# EAGLE design ShieldWing (EAGLE 9.0.1)
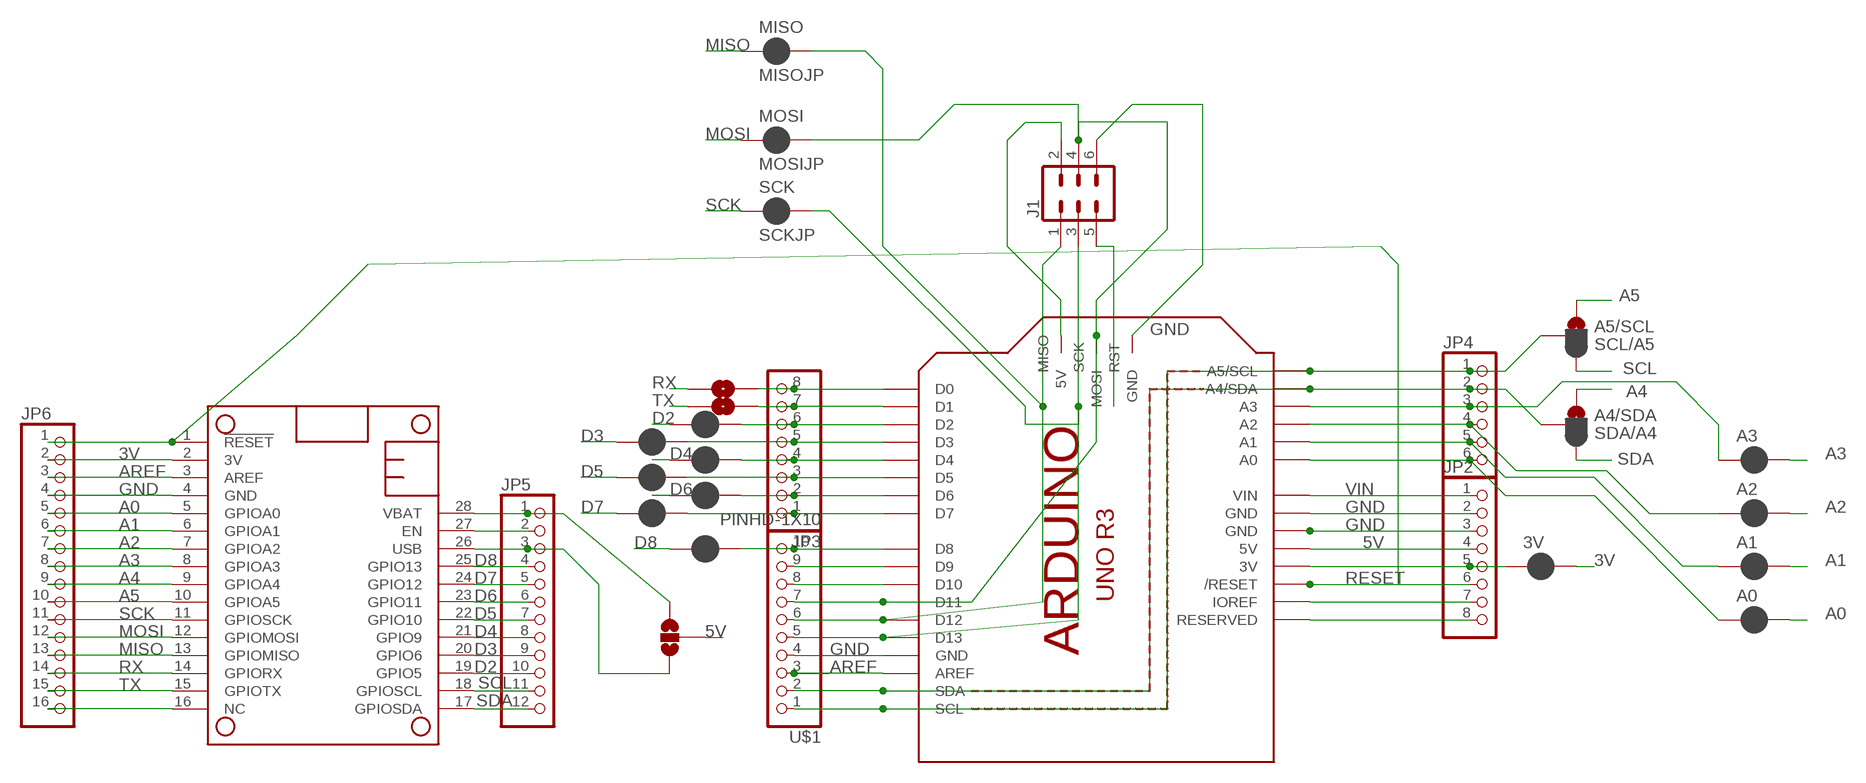
[diagram p0: schematic, sheet 1]

## Parts
3V  JUMPER-SMT_2_NC_PASTE_SILK  [SMT-JUMPER_2_NC_PASTE_SILK]
5V  JUMPER-SMT_3_NO_SILK  [SMT-JUMPER_3_NO_SILK]
A0  JUMPER-SMT_2_NC_PASTE_SILK  [SMT-JUMPER_2_NC_PASTE_SILK]
A1  JUMPER-SMT_2_NC_PASTE_SILK  [SMT-JUMPER_2_NC_PASTE_SILK]
A2  JUMPER-SMT_2_NC_PASTE_SILK  [SMT-JUMPER_2_NC_PASTE_SILK]
A3  JUMPER-SMT_2_NC_PASTE_SILK  [SMT-JUMPER_2_NC_PASTE_SILK]
A4/SDA  SDA/A4  JUMPER-SMT_3_1-NC_PASTE_SILK  [SMT-JUMPER_3_1-NC_PASTE_SILK]
A5/SCL  SCL/A5  JUMPER-SMT_3_1-NC_PASTE_SILK  [SMT-JUMPER_3_1-NC_PASTE_SILK]
D2  JUMPER-SMT_2_NC_PASTE_SILK  [SMT-JUMPER_2_NC_PASTE_SILK]
D3  JUMPER-SMT_2_NC_PASTE_SILK  [SMT-JUMPER_2_NC_PASTE_SILK]
D4  JUMPER-SMT_2_NC_PASTE_SILK  [SMT-JUMPER_2_NC_PASTE_SILK]
D5  JUMPER-SMT_2_NC_PASTE_SILK  [SMT-JUMPER_2_NC_PASTE_SILK]
D6  JUMPER-SMT_2_NC_PASTE_SILK  [SMT-JUMPER_2_NC_PASTE_SILK]
D7  JUMPER-SMT_2_NC_PASTE_SILK  [SMT-JUMPER_2_NC_PASTE_SILK]
D8  JUMPER-SMT_2_NC_PASTE_SILK  [SMT-JUMPER_2_NC_PASTE_SILK]
J1  CONN_03X22X3_SILK_MALE_PTH  [2X3]
JP2  PINHD-1X8CLEANBIG  [1X08-CLEANBIG]
JP3  PINHD-1X8CLEANBIG  [1X08-CLEANBIG]
JP4  PINHD-1X6B  [1X06-BIG]
JP5  PINHD-1X12  [1X12]
JP6  PINHD-1X16  [1X16]
M1  ARDUINO_R3_ICSP_NODIM  [ARDUINOR3_ICSP_NODIM]
MISO  MISOJP  JUMPER-SMT_2_NC_PASTE_SILK  [SMT-JUMPER_2_NC_PASTE_SILK]
MOSI  MOSIJP  JUMPER-SMT_2_NC_PASTE_SILK  [SMT-JUMPER_2_NC_PASTE_SILK]
MS1  FEATHERWING_NODIM  [FEATHERWING_DIM]
RX  JUMPER-SMT_2_NO_SILK  [SMT-JUMPER_2_NO_SILK]
SCK  SCKJP  JUMPER-SMT_2_NC_PASTE_SILK  [SMT-JUMPER_2_NC_PASTE_SILK]
TX  JUMPER-SMT_2_NO_SILK  [SMT-JUMPER_2_NO_SILK]
U$1  PINHD-1X10  [1X10-BIG]

## Nets
3V: 3V.2 JP6.2 MS1.2(3V)
5V: 5V.2 JP2.4 M1.5V
A0: A0.2 JP6.5 MS1.5(GPIOA0)
A1: A1.2 JP6.6 MS1.6(GPIOA1)
A2: A2.2 JP6.7 MS1.7(GPIOA2)
A3: A3.2 JP6.8 MS1.8(GPIOA3)
A4: A4/SDA.1 JP6.9 MS1.9(GPIOA4)
A5: A5/SCL.1 JP6.10 MS1.10(GPIOA5)
AREF: JP6.3 M1.AREF MS1.3(AREF) U$1.3
D2: D2.1 JP5.10 MS1.19(GPIO5)
D3: D3.1 JP5.9 MS1.20(GPIO6)
D4: D4.1 JP5.8 MS1.21(GPIO9)
D5: D5.1 JP5.7 MS1.22(GPIO10)
D6: D6.1 JP5.6 MS1.23(GPIO11)
D7: D7.1 JP5.5 MS1.24(GPIO12)
D8: D8.1 JP5.4 MS1.25(GPIO13)
GND: J1.6 JP2.2 JP2.3 JP6.4 M1.GND M1.GND@1(GND) M1.GND@2(GND) M1.GND@3(GND) MS1.4(GND) U$1.4
MISO: JP6.13 MISO.1 MS1.13(GPIOMISO)
MOSI: JP6.12 MOSI.1 MS1.12(GPIOMOSI)
N$1: JP3.7 M1.D1 TX.2
N$2: JP3.8 M1.D0 RX.2
N$3: JP5.2 MS1.27(EN)
N$10: A4/SDA.2 JP4.2 M1.A4(A4/SDA) M1.SDA U$1.2
N$11: A5/SCL.2 JP4.1 M1.A5(A5/SCL) M1.SCL U$1.1
N$12: 3V.1 JP2.5 M1.3V
N$13: A3.1 JP4.3 M1.A3
N$14: A2.1 JP4.4 M1.A2
N$15: A1.1 JP4.5 M1.A1
N$16: A0.1 JP4.6 M1.A0
N$18: JP2.7 M1.IOREF
N$19: JP2.8 M1.RESERVED
N$20: J1.3 M1.D13 M1.SCK SCK.2 U$1.5
N$21: J1.1 M1.D12 M1.MISO MISO.2 U$1.6
N$22: J1.4 M1.D11 M1.MOSI MOSI.2 U$1.7
N$23: M1.D10 U$1.8
N$24: M1.D9 U$1.9
N$25: D8.2 M1.D8 U$1.10
N$26: D7.2 JP3.1 M1.D7
N$27: D6.2 JP3.2 M1.D6
N$28: D5.2 JP3.3 M1.D5
N$29: D4.2 JP3.4 M1.D4
N$30: D3.2 JP3.5 M1.D3
N$31: D2.2 JP3.6 M1.D2
N$32: J1.2 M1.5V_ICSP(5V)
N$35: J1.5 M1.RESET_ICSP(RST)
N$45: JP6.16 MS1.16(NC)
RESET: JP2.6 JP6.1 M1.RESET(/RESET) MS1.1(!RESET)
RX: JP6.14 MS1.14(GPIORX) RX.1
SCK: JP6.11 MS1.11(GPIOSCK) SCK.1
SCL: A5/SCL.3 JP5.11 MS1.18(GPIOSCL)
SDA: A4/SDA.3 JP5.12 MS1.17(GPIOSDA)
TX: JP6.15 MS1.15(GPIOTX) TX.1
USB: 5V.1 JP5.3 MS1.26(USB)
VBAT: 5V.3 JP5.1 MS1.28(VBAT)
VIN: JP2.1 M1.VIN

## Library data of the parts
3V A0 A1-A3 D2-D8 MISO MOSI SCK = SparkFun-Jumpers:JUMPER-SMT_2_NC_PASTE: Normally closed solder jumper This jumper has an aperture in the stencil to allow solder paste to bridge the split in the wire so it's normally closed (NC). Wick off the solder to open the connection. Reapply solder to reclose the connection.
5V = SparkFun-Jumpers:JUMPER-SMT_3_NO: Normally open jumper This jumper has three pads in close proximity to each other. Apply solder to close the connection(s).
A4/SDA A5/SCL = SparkFun-Jumpers:JUMPER-SMT_3_1-NC_PASTE: Normally closed solder jumper (1 of 2 connections) This jumper has an aperture in the stencil to allow solder paste to bridge one of the two connections. One connection is normally closed (NC), while the other is normally open (NO). Wick off the solder to open the connection. Reapply solder to reclose the connection. Apply solder to the other side instead to change the current path.
J1 = SparkFun-Connectors:CONN_03X2: Multi connection point. Often used as Generic Header-pin footprint for 0.1 inch spaced/style header connections You can populate with any combo of single row headers, but if you'd like an exact match, check these: Header - 2x3 (Male, 0.1") <https://www.sparkfun.com/products/12807> (PRT-12807) Header - 2x3 (Female, 0.1") <https://www.sparkfun.com/products/13010> (PRT-13010) 2x3 Pin Shrouded Header <https://www.sparkfun.com/products/10877> (PRT-10877) On any of the 0.1 inch spaced packages, you can populate with these: Break Away Headers - Straight <https://www.sparkfun.com/products/116> (PRT-00116) Break Away Male Headers - Right Angle <https://www.sparkfun.com/products/553> (PRT-00553) Female Headers <https://www.sparkfun.com/products/115> (PRT-00115) Break Away Headers - Machine Pin <https://www.sparkfun.com/products/117> (PRT-00117) Break Away Female Headers - Swiss Machine Pin <https://www.sparkfun.com/products/743> (PRT-00743) Special note: the shrouded connector mates well with our 3x2 ribbon cables: Ribbon Crimp Connector - 6-pin (2x3, Female) <https://www.sparkfun.com/products/10651> (PRT-10651) Ribbon Cable - 6 wire (15ft) <https://www.sparkfun.com/products/10646> (PRT-10646); PROD_ID: CONN-09701
JP2 JP3 = adafruit:PINHD-1X8: PIN HEADER
JP4 = adafruit:PINHD-1X6: PIN HEADER
JP5 = adafruit:PINHD-1X12: PIN HEADER
JP6 = pinhead:PINHD-1X16: PIN HEADER
M1 = adafruit:ARDUINO_R3_ICSP
MS1 = adafruit:FEATHERWING
RX TX = SparkFun-Jumpers:JUMPER-SMT_2_NO: Normally open jumper This jumper has two pads in close proximity to each other. Apply solder to close the connection. Round pads are easier to solder for beginners, but are a lot larger. SparkFun Product that uses the round pads: SparkFun EL Sequencer <https://www.sparkfun.com/products/12781>
U$1 = adafruit:PINHD-1X10: Pin header 1x10 0.1" spacing With round pins

## Board
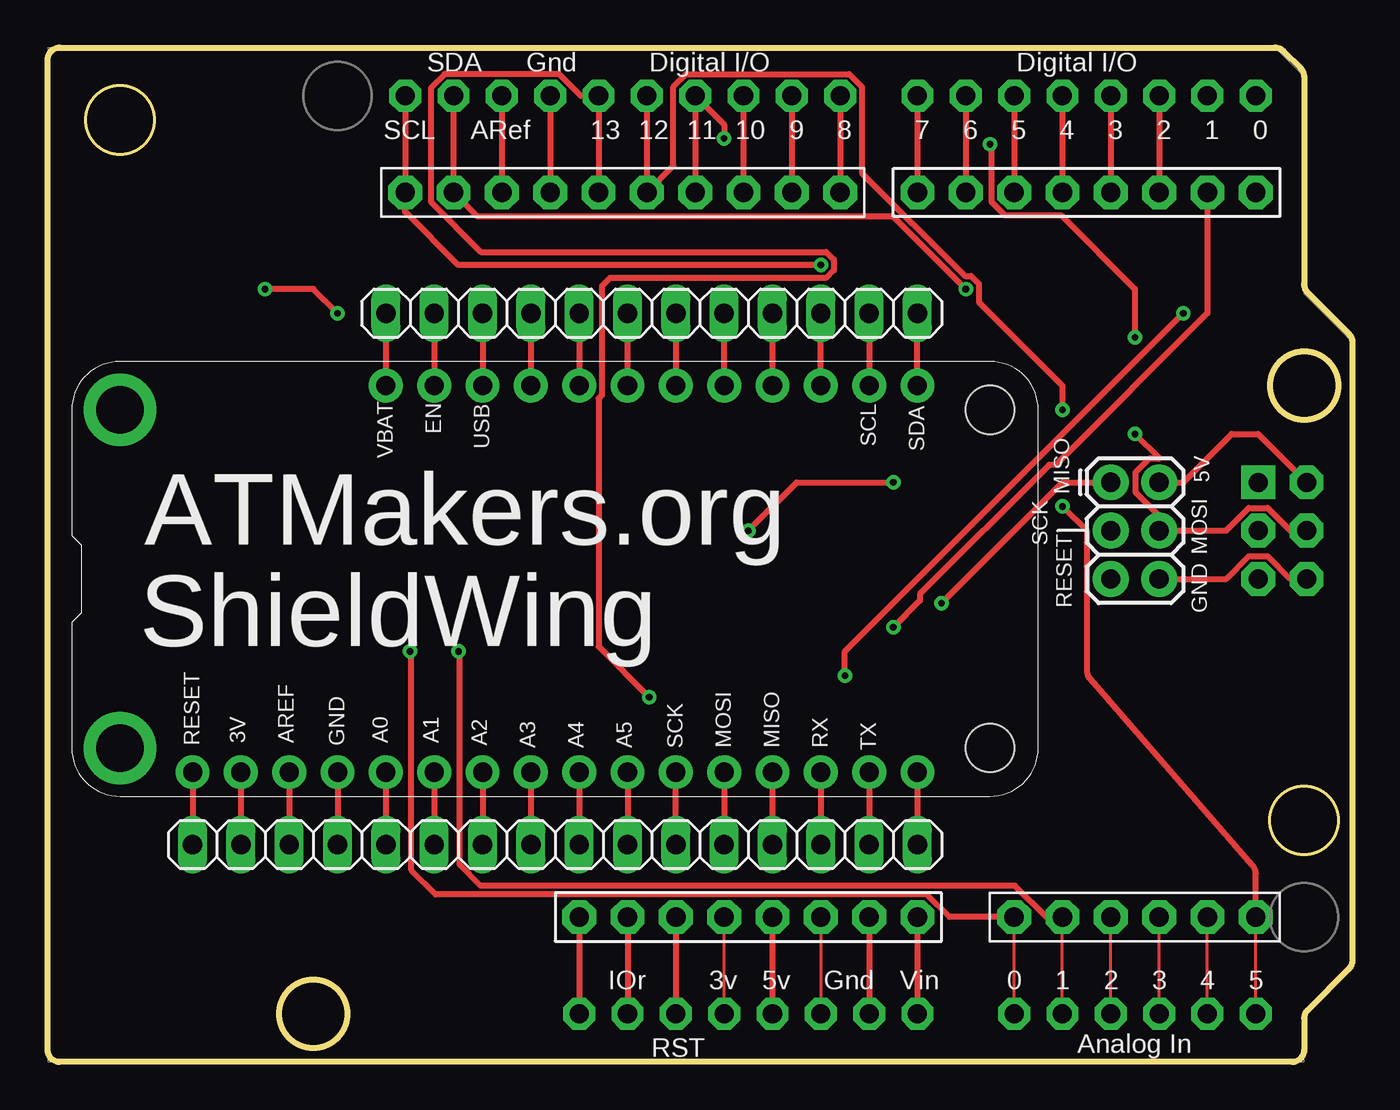
[diagram p1: board, top side]
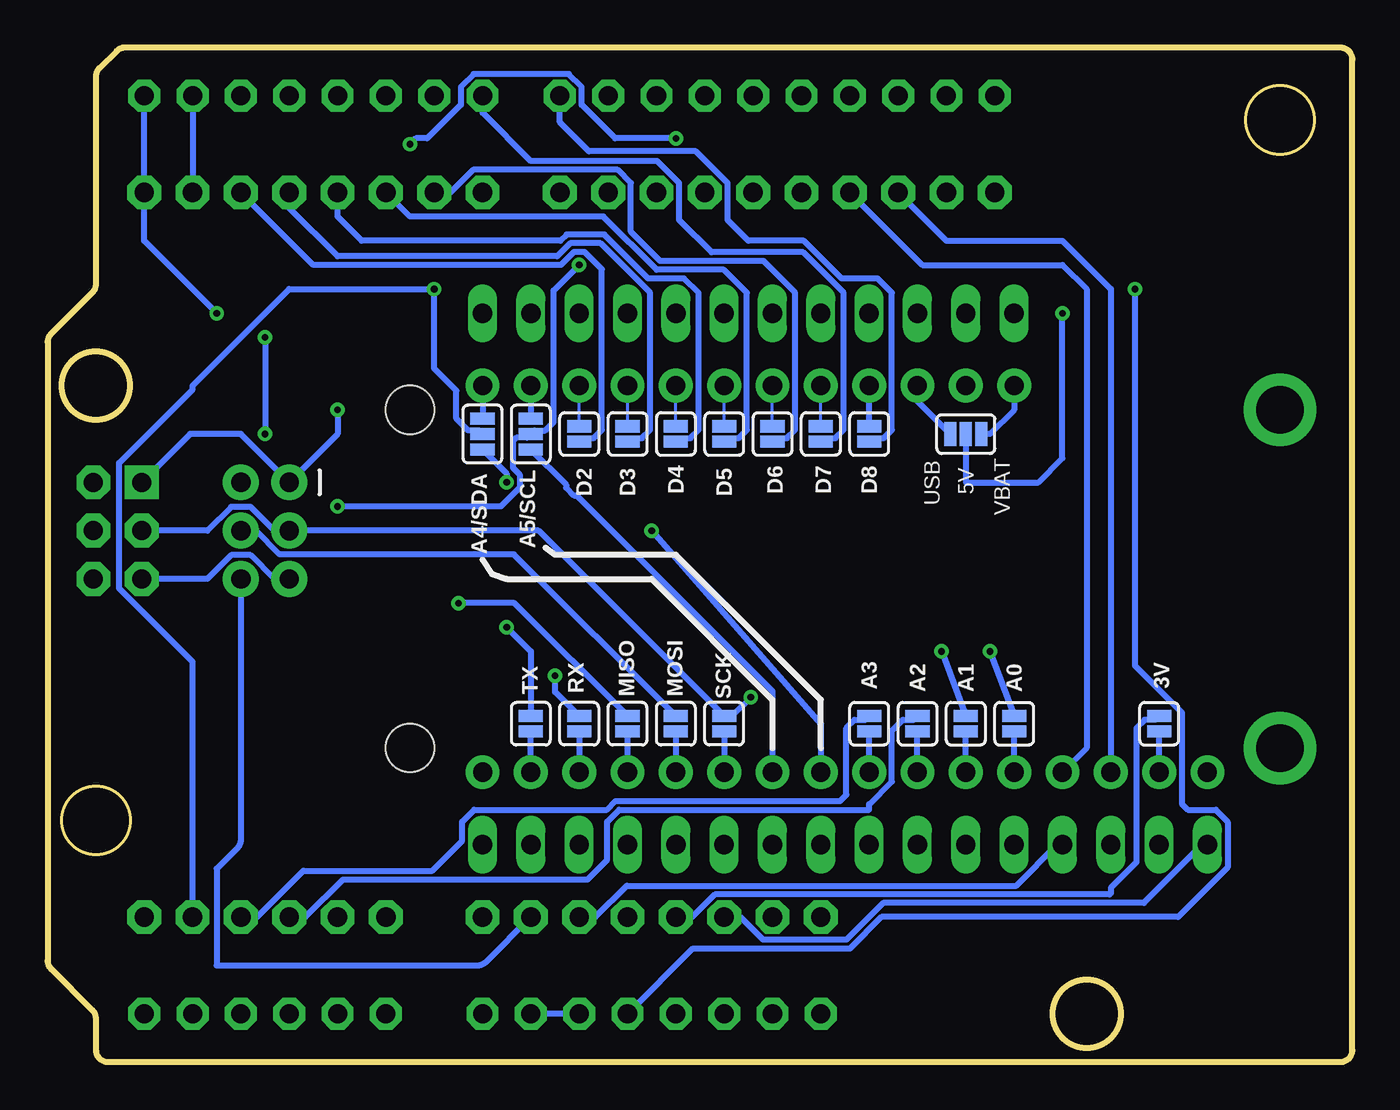
[diagram p2: board, bottom side, seen from below]

Size 68.58 x 53.34 mm. Coordinates in mm from the lower left corner, seen from the top.
Outline: 65.41,0 0.64,0 arc-90 0,0.64 0,52.7 arc-90 0.64,53.34 64.51,53.34 arc-45 64.96,53.15 65.85,52.26 arc-45 66.04,51.81 66.04,40.9 arc45 66.23,40.45 68.39,38.29 arc-45 68.58,37.84 68.58,5.34 arc-45 68.39,4.89 66.23,2.73 arc45 66.04,2.28 66.04,0.64 arc-90 65.41,0
Outline: circle at 13.97,2.54 radius 1.8
Outline: circle at 66.04,35.56 radius 1.8
Outline: circle at 3.81,49.53 radius 1.8
Outline: circle at 66.04,12.7 radius 1.8
Copper layers (1*16): Top 0.035mm / dielectric 1.5mm / Bottom 0.035mm
Design rules "default *": minimum track width 6mil, minimum drill 0.35mm, track to track 6mil, track to pad 6mil, pad to pad 6mil, via to via 6mil, smd to smd 6mil, copper to edge 40mil, drill to drill 6mil, minimum pad ring 10mil, minimum via ring 8mil, stop-mask expansion 4mil, vias tented up to drill 20mil, thermal gap 10mil

### Footprints (pad centres in the part's own frame; a part is rotated, then mirrored left to right if it is on the bottom)
SMT-JUMPER_2_NC_PASTE_SILK = smd 0.635 x 1.27: 1 -0.406,0; 2 0.406,0
SMT-JUMPER_3_NO_SILK = smd 0.635 x 1.27: 1 -0.813,0; 2 0,0; 3 0.813,0
SMT-JUMPER_3_1-NC_PASTE_SILK = smd 0.635 x 1.27: 1 -0.813,0; 2 0,0; 3 0.813,0
2X3 = drill 1.016 pad 1.88: 1 0,0; 2 0,2.54; 3 2.54,0; 4 2.54,2.54; 5 5.08,0; 6 5.08,2.54
1X08-CLEANBIG = drill 1.016 pad 1.778 octagon: 1 -8.89,0; 2 -6.35,0; 3 -3.81,0; 4 -1.27,0; 5 1.27,0; 6 3.81,0; 7 6.35,0; 8 8.89,0
1X06-BIG = drill 1.016 pad 1.778 octagon: 1 -6.35,0; 2 -3.81,0; 3 -1.27,0; 4 1.27,0; 5 3.81,0; 6 6.35,0
1X12 = drill 1.016 long: 1 -13.97,0; 2 -11.43,0; 3 -8.89,0; 4 -6.35,0; 5 -3.81,0; 6 -1.27,0; 7 1.27,0; 8 3.81,0; 9 6.35,0; 10 8.89,0; 11 11.43,0; 12 13.97,0
1X16 = drill 1.016 long: 1 -19.05,0; 2 -16.51,0; 3 -13.97,0; 4 -11.43,0; 5 -8.89,0; 6 -6.35,0; 7 -3.81,0; 8 -1.27,0; 9 1.27,0; 10 3.81,0; 11 6.35,0; 12 8.89,0; 13 11.43,0; 14 13.97,0; 15 16.51,0; 16 19.05,0
ARDUINOR3_ICSP_NODIM = drill 1 pad 1.676 octagon: 3V 35.56,2.54; 5V 38.1,2.54; A0 50.8,2.54; A1 53.34,2.54; A2 55.88,2.54; A3 58.42,2.54; A4 60.96,2.54; A5 63.5,2.54; AREF 23.876,50.8; D0 63.5,50.8; D1 60.96,50.8; D2 58.42,50.8; D3 55.88,50.8; D4 53.34,50.8; D5 50.8,50.8; D6 48.26,50.8; D7 45.72,50.8; D8 41.656,50.8; D9 39.116,50.8; D10 36.576,50.8; D11 34.036,50.8; D12 31.496,50.8; D13 28.956,50.8; GND 26.416,50.8; GND@1 43.18,2.54; GND@2 40.64,2.54; IOREF 30.48,2.54; RESERVED 27.94,2.54; RESET 33.02,2.54; SCL 18.796,50.8; SDA 21.336,50.8; VIN 45.72,2.54 | drill 1 pad 1.778 octagon: 5V_ICSP 66.167,30.48; GND@3 66.167,25.4; MOSI 66.167,27.94; RESET_ICSP 63.627,25.4; SCK 63.627,27.94 | drill 1 pad 1.778 square: MISO 63.627,30.48
FEATHERWING_DIM = drill 1 pad 1.778: 1 6.35,1.27; 2 8.89,1.27; 3 11.43,1.27; 4 13.97,1.27; 5 16.51,1.27; 6 19.05,1.27; 7 21.59,1.27; 8 24.13,1.27; 9 26.67,1.27; 10 29.21,1.27; 11 31.75,1.27; 12 34.29,1.27; 13 36.83,1.27; 14 39.37,1.27; 15 41.91,1.27; 16 44.45,1.27; 17 44.45,21.59; 18 41.91,21.59; 19 39.37,21.59; 20 36.83,21.59; 21 34.29,21.59; 22 31.75,21.59; 23 29.21,21.59; 24 26.67,21.59; 25 24.13,21.59; 26 21.59,21.59; 27 19.05,21.59; 28 16.51,21.59 | drill 2.5 pad 3.81: P$1 2.54,20.32; P$2 2.54,2.54 | hole 2.54: 48.26,20.32; 48.26,2.54
SMT-JUMPER_2_NO_SILK = smd 0.635 x 1.27: 1 -0.406,0; 2 0.406,0
1X10-BIG = drill 1.016 pad 1.778 octagon: 1 -11.43,0; 2 -8.89,0; 3 -6.35,0; 4 -3.81,0; 5 -1.27,0; 6 1.27,0; 7 3.81,0; 8 6.35,0; 9 8.89,0; 10 11.43,0

### Placement (x,y rotation side)
3V  10.16,17.78 270 bottom
5V  20.32,33.02 0 bottom
A0  17.78,17.78 270 bottom
A1  20.32,17.78 270 bottom
A2  22.86,17.78 270 bottom
A3  25.4,17.78 270 bottom
A4/SDA  45.72,33.02 90 bottom
A5/SCL  43.18,33.02 90 bottom
D2  40.64,33.02 270 bottom
D3  38.1,33.02 270 bottom
D4  35.56,33.02 270 bottom
D5  33.02,33.02 270 bottom
D6  30.48,33.02 270 bottom
D7  27.94,33.02 270 bottom
D8  25.4,33.02 270 bottom
J1  55.88,30.48 270 top
JP2  36.83,7.62 180 top
JP3  54.61,45.72 0 top
JP4  57.15,7.62 180 top
JP5  31.75,39.37 0 top
JP6  26.67,11.43 0 top
M1  0,0 0 top
MISO  38.1,17.78 90 bottom
MOSI  35.56,17.78 90 bottom
MS1  1.27,13.97 0 top
RX  40.64,17.78 90 bottom
SCK  33.02,17.78 90 bottom
TX  43.18,17.78 90 bottom
U$1  30.23,45.72 0 top

### Tracks (layer width: path | path; a pad name or v marks a point on that pad's centre or on a via)
3V
  Top 0.305: MS1.2 JP6.2
  Bottom 0.305: MS1.2 3V.2
5V  (via drill 0.35)
  Top 0.305: JP2.4 M1.5V | v15.24,39.37 13.97,40.64 v11.43,40.64
  Bottom 0.305: M1.5V 34.67,5.97 26.4,5.97 24.75,7.62 9.16,7.62 6.55,10.23 6.55,12.63 7.18,13.26 8.65,13.26 8.97,13.57 8.97,18.38 11.43,20.84 v11.43,40.64 | 5V.2 20.32,30.48 16.51,30.48 15.24,31.75 v15.24,39.37
A0
  Top 0.305: MS1.5 JP6.5
  Bottom 0.305: MS1.5 A0.2
A1
  Top 0.305: MS1.6 JP6.6
  Bottom 0.305: MS1.6 A1.2
A2
  Top 0.305: MS1.7 JP6.7
  Bottom 0.305: MS1.7 A2.2
A3
  Top 0.305: MS1.8 JP6.8
  Bottom 0.305: MS1.8 A3.2
A4  (via drill 0.35)
  Top 0.305: MS1.9 JP6.9 | v36.83,27.94 39.37,30.48 v44.45,30.48
  Bottom 0.305: A4/SDA.1 44.45,30.94 v44.45,30.48 | v36.83,27.94 27.94,17.78 MS1.9
A5
  Top 0.305: MS1.10 JP6.10
  Bottom 0.305: MS1.10 30.48,19.51 40.77,29.8 40.92,29.8 41.32,30.2 41.32,30.35 A5/SCL.1
AREF
  Top 0.305: M1.AREF U$1.3 | MS1.3 JP6.3
  Bottom 0.305: U$1.3 21.34,43.18 15.24,43.18 12.7,40.64 MS1.3
D2
  Top 0.305: MS1.19 JP5.10
  Bottom 0.152: D2.1 MS1.19
D3
  Top 0.305: JP5.9 MS1.20
  Bottom 0.152: D3.1 MS1.20
D4
  Top 0.305: MS1.21 JP5.8
  Bottom 0.152: D4.1 MS1.21
D5
  Top 0.305: JP5.7 MS1.22
  Bottom 0.152: D5.1 MS1.22
D6
  Top 0.305: MS1.23 JP5.6
  Bottom 0.152: D6.1 MS1.23
D7
  Top 0.305: JP5.5 MS1.24
  Bottom 0.152: D7.1 MS1.24
D8
  Top 0.305: JP5.4 MS1.25
  Bottom 0.305: D8.1 MS1.25
GND
  Top 0.152: JP2.3 M1.GND@2
  Top 0.305: M1.GND U$1.4 | MS1.4 JP6.4 | JP2.2 M1.GND@1 | J1.6 61.94,25.4 63.13,26.59 64.12,26.59 65.31,25.4 M1.GND@3
  Bottom 0.305: U$1.4 22.61,41.91 15.24,41.91 13.97,40.64 13.97,16.51 MS1.4 | M1.GND@2 M1.GND@1 | JP2.3 39.79,7.62 38.14,9.27 17.67,9.27 15.51,11.43 JP6.4 | J1.6 58.42,11.69 arc45 58.61,11.24 59.69,10.16 59.69,5.08 45.98,5.08 arc-45 45.53,5.27 JP2.2
MISO
  Top 0.305: MS1.13 JP6.13
  Bottom 0.305: MS1.13 MISO.1
MOSI
  Top 0.305: MS1.12 JP6.12
  Bottom 0.305: MOSI.1 MS1.12
N$1  (via drill 0.35)
  Top 0.305: JP3.7 60.96,39.37 52.98,31.39 52.64,31.39 45.85,24.6 45.85,24.26 v44.45,22.86
  Bottom 0.305: v44.45,22.86 43.18,21.59 TX.2 | M1.D1 JP3.7
N$2  (via drill 0.35)
  Top 0.305: v41.91,20.32 41.91,21.59 v59.69,39.37
  Bottom 0.305: M1.D0 JP3.8 63.5,43.18 v59.69,39.37 | RX.2 41.91,19.46 v41.91,20.32
N$3
  Top 0.305: JP5.2 MS1.27
N$10  (via drill 0.35)
  Top 0.152: M1.A4 JP4.2
  Top 0.305: M1.SDA U$1.2 22.61,44.45 44.45,44.45 v48.26,40.64
  Bottom 0.305: A4/SDA.2 45.91,33.21 46.48,33.21 47.09,33.82 47.09,35.3 48.26,36.47 v48.26,40.64 55.88,40.64 60.96,35.56 60.96,35.36 64.82,31.5 64.82,25.4 64.82,24.91 60.96,21.05 JP4.2
N$11  (via drill 0.35)
  Top 0.152: M1.A5 JP4.1
  Top 0.305: M1.SCL U$1.1 18.8,44.7 21.59,41.91 v40.64,41.91 | v53.34,29.21 54.63,27.91 54.63,20.56 arc45 54.82,20.11 63.31,10.35 arc-45 63.5,9.9 JP4.1
  Bottom 0.305: v40.64,41.91 41.99,40.56 41.99,33.64 42.42,33.21 42.99,33.21 A5/SCL.2 43.37,32.83 43.94,32.83 44.12,32.65 44.12,31.25 43.77,30.9 43.77,30.2 44.75,29.21 v53.34,29.21
N$12
  Top 0.152: M1.3V JP2.5
  Bottom 0.305: 3V.1 10.35,18 10.92,18 11.35,17.56 11.35,10.51 12.7,9.16 12.7,8.89 12.78,8.81 33.51,8.81 34.71,7.62 JP2.5
N$13
  Top 0.152: M1.A3 JP4.3
  Bottom 0.305: JP4.3 57.57,7.62 55.13,10.06 48.36,10.06 46.79,11.63 46.79,12.63 46.16,13.26 39.19,13.26 38.73,13.72 26.92,13.72 26.59,14.05 26.59,17.56 26.16,18 25.59,18 A3.1
N$14
  Top 0.152: M1.A2 JP4.4
  Bottom 0.305: JP4.4 55.03,7.62 53.05,9.6 40.2,9.6 39.17,10.63 39.17,12.63 38.54,13.26 25.4,13.26 25.4,13.55 24.21,14.75 24.21,17.41 23.62,18 23.05,18 A2.1
N$15  (via drill 0.35)
  Top 0.152: M1.A1 JP4.5
  Top 0.305: JP4.5 52.49,7.62 50.84,9.27 22.75,9.27 21.67,10.35 21.67,21.51 v21.59,21.59
  Bottom 0.305: v21.59,21.59 A1.1
N$16  (via drill 0.35)
  Top 0.152: M1.A0 JP4.6
  Top 0.305: JP4.6 47.41,7.62 46.21,8.81 20.4,8.81 19.13,10.08 19.13,21.51 v19.05,21.59
  Bottom 0.305: v19.05,21.59 A0.1
N$18
  Top 0.305: JP2.7 M1.IOREF
N$19
  Top 0.305: JP2.8 M1.RESERVED
N$20  (via drill 0.35)
  Top 0.305: U$1.5 M1.D13 28.03,50.8 26.89,51.94 20.86,51.94 20.14,51.22 20.14,45.23 22.77,42.59 40.92,42.59 41.32,42.19 41.32,41.63 40.92,41.23 29.56,41.23 29.13,40.8 29.13,35.07 28.96,34.89 28.96,21.84 v31.62,19.18
  Bottom 0.305: M1.SCK 60.18,27.94 58.94,29.18 57.9,29.18 56.66,27.94 J1.3 42.77,27.94 SCK.2 32.61,18.19 v31.62,19.18
N$21  (via drill 0.35)
  Top 0.305: M1.D12 U$1.6 32.89,47.12 32.89,51.27 33.56,51.94 42.13,51.94 42.8,51.27 42.8,46.75 48.22,41.32 48.54,41.32 48.94,40.92 48.94,39.96 53.34,35.56 v53.34,34.29 | v46.99,24.13 53.34,30.48 J1.1
  Bottom 0.305: M1.MISO 61.09,33.02 58.42,33.02 J1.1 53.34,33.02 v53.34,34.29 | MISO.2 44.04,24.13 v46.99,24.13
N$22  (via drill 0.35)
  Top 0.305: U$1.7 M1.D11 35.56,49.28 v35.56,48.56 | M1.MOSI 65.31,27.94 64.12,29.13 63.13,29.13 61.94,27.94 J1.4 58.42,28.72 57.17,29.96 57.17,31 57.9,31.73 58.4,31.73 58.42,31.75 v57.15,33.02 | v57.15,38.1 57.15,40.64 53.26,44.53 50.31,44.53 49.61,45.23 49.61,48.18 v49.53,48.26
  Bottom 0.305: MOSI.2 44.07,26.7 56.4,26.7 57.64,27.94 J1.4 | v49.53,48.26 49.23,48.56 48.63,48.56 46.86,50.33 46.86,51.27 46.19,51.94 41.18,51.94 40.51,51.27 40.51,50.33 38.75,48.56 v35.56,48.56 | v57.15,38.1 v57.15,33.02
N$23
  Top 0.305: M1.D10 U$1.8
N$24
  Top 0.305: M1.D9 U$1.9
N$25
  Top 0.305: M1.D8 U$1.10
  Bottom 0.305: D8.2 25.21,32.8 24.64,32.8 24.21,33.24 24.21,40.45 24.96,41.2 26.85,41.2 28.83,43.18 31.75,43.18 32.84,44.27 32.84,46.21 34.51,47.88 40.13,47.88 41.66,49.4 M1.D8
N$26
  Top 0.305: M1.D7 JP3.1
  Bottom 0.305: D7.2 27.75,32.8 27.18,32.8 26.75,33.24 26.75,40.45 28.87,42.57 33.68,42.57 35.38,44.27 35.38,46.21 36.54,47.37 43.18,47.37 45.72,49.91 M1.D7
N$27
  Top 0.305: M1.D6 JP3.2
  Bottom 0.305: D6.2 30.29,32.8 29.72,32.8 29.29,33.24 29.29,40.45 30.95,42.11 36.39,42.11 37.92,43.65 37.92,46.21 38.62,46.91 46.21,46.91 47.41,45.72 JP3.2
N$28
  Top 0.305: M1.D5 JP3.3
  Bottom 0.305: D5.2 32.83,32.8 32.26,32.8 31.83,33.24 31.83,40.45 33.03,41.66 36.58,41.66 39.37,44.45 49.53,44.45 JP3.3
N$29
  Top 0.305: M1.D4 JP3.4
  Bottom 0.305: D4.2 35.37,32.8 34.8,32.8 34.37,33.24 34.37,40.45 35.12,41.2 37.01,41.2 39.32,43.51 41.3,43.51 41.63,43.18 52.07,43.18 53.34,44.45 JP3.4
N$30
  Top 0.305: M1.D3 JP3.5
  Bottom 0.305: D3.2 37.91,32.8 37.34,32.8 36.91,33.24 36.91,40.45 39.51,43.05 41.11,43.05 41.8,42.37 53.34,42.37 55.88,44.91 JP3.5
N$31
  Top 0.305: M1.D2 JP3.6
  Bottom 0.305: D2.2 40.45,32.8 39.88,32.8 39.45,33.24 39.45,41.68 40.36,42.59 40.92,42.59 41.61,41.91 54.61,41.91 JP3.6
N$32
  Top 0.305: J1.2 59.69,30.48 62.23,33.02 63.63,33.02 M1.5V_ICSP
N$35
  Bottom 0.305: J1.5 56.66,25.4 57.9,26.64 58.94,26.64 60.18,25.4 M1.RESET_ICSP
N$45
  Top 0.305: MS1.16 JP6.16
RESET
  Top 0.305: MS1.1 JP6.1 | JP2.6 M1.RESET
  Bottom 0.305: JP6.1 7.89,11.43 10.96,8.36 24.66,8.36 26.59,6.43 30.97,6.43 32.17,7.62 JP2.6
RX
  Top 0.305: MS1.14 JP6.14
  Bottom 0.305: RX.1 MS1.14
SCK
  Top 0.305: JP6.11 MS1.11
  Bottom 0.305: SCK.1 MS1.11
SCL
  Top 0.305: JP5.11 MS1.18
  Bottom 0.305: MS1.18 A5/SCL.3
SDA
  Top 0.305: MS1.17 JP5.12
  Bottom 0.305: MS1.17 A4/SDA.3
TX
  Top 0.305: MS1.15 JP6.15
  Bottom 0.305: MS1.15 TX.1
USB
  Top 0.305: JP5.3 MS1.26
  Bottom 0.305: MS1.26 22.86,34.75 5V.1
VBAT
  Top 0.305: JP5.1 MS1.28
  Bottom 0.305: MS1.28 17.78,34.29 19.05,33.02 5V.3
VIN
  Top 0.305: JP2.1 M1.VIN

### Text on the board
tPlace: EN | VBAT | USB | SCL | SDA | MISO | 5V | SCK | MOSI | RESET | GND | RESET | 3V | AREF | GND | A0 | A1 | A2 | A3 | A4 | A5 | SCK | MOSI | MISO | RX | TX
tNames: ATMakers.org | ShieldWing
bNames: VBAT | USB | 5V
Vscore: ATMakers.org | ShieldWing